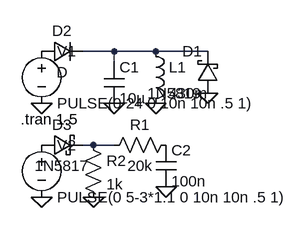
[diagram p0: schematic precharge_currentlimit_relay.asc]
precharge_currentlimit_relay.asc, the LTspice schematic file:
Version 4
SHEET 1 880 680
WIRE 128 128 80 128
WIRE 192 128 128 128
WIRE 272 128 192 128
WIRE 128 144 128 128
WIRE 96 272 80 272
WIRE 128 272 96 272
FLAG 128 208 0
FLAG 192 208 0
FLAG 272 192 0
FLAG 16 208 0
FLAG 16 352 0
FLAG 208 336 0
FLAG 96 352 0
SYMBOL ind 176 112 R0
SYMATTR InstName L1
SYMATTR Value 430m
SYMATTR SpiceLine Rser=1800
SYMBOL schottky 288 192 R180
WINDOW 0 24 64 Left 2
WINDOW 3 24 0 Left 2
SYMATTR InstName D1
SYMATTR Value 1N5819
SYMATTR Description Diode
SYMATTR Type diode
SYMBOL diode 16 144 R270
WINDOW 0 32 32 VTop 2
WINDOW 3 0 32 VBottom 2
SYMATTR InstName D2
SYMBOL cap 112 144 R0
SYMATTR InstName C1
SYMATTR Value 10µ
SYMBOL voltage 16 112 R0
WINDOW 123 0 0 Left 0
WINDOW 39 0 0 Left 0
SYMATTR InstName V1
SYMATTR Value PULSE(0 24 0 10n 10n .5 1)
SYMBOL voltage 16 256 R0
WINDOW 123 0 0 Left 0
WINDOW 39 0 0 Left 0
SYMATTR InstName V2
SYMATTR Value PULSE(0 5-3*1.1 0 10n 10n .5 1)
SYMBOL cap 192 272 R0
SYMATTR InstName C2
SYMATTR Value 100n
SYMBOL res 224 256 R90
WINDOW 0 0 56 VBottom 2
WINDOW 3 32 56 VTop 2
SYMATTR InstName R1
SYMATTR Value 20k
SYMBOL schottky 16 288 R270
WINDOW 0 32 32 VTop 2
WINDOW 3 0 32 VBottom 2
SYMATTR InstName D3
SYMATTR Value 1N5817
SYMATTR Description Diode
SYMATTR Type diode
SYMBOL res 80 256 R0
SYMATTR InstName R2
SYMATTR Value 1k
TEXT -16 232 Left 2 !.tran 1.5

The netlist it stands for:
* precharge_currentlimit_relay.asc
L1 N001 0 430m Rser=1800
D1 0 N001 1N5819
D2 P001 N001 D
C1 N001 0 10µ
V1 P001 0 PULSE(0 24 0 10n 10n .5 1)
V2 P002 0 PULSE(0 5-3*1.1 0 10n 10n .5 1)
C2 P003 0 100n
R1 P003 N002 20k
D3 P002 N002 1N5817
R2 N002 0 1k
.model D D
.lib standard.dio
.tran 1.5
.backanno
.end